# Altium schematic sheet ASIC_2.SchDoc: Title
size A2; Date: Date; CompanyName: Integrated Micro-Electronics Bulgaria; Organization: Design & Development Department; Address1: Drawing Type; Address2: Address 1; Address3: Address 2; Address4: Address 3; DocumentNumber: 730xxx; Revision: 01; SheetNumber: 1; SheetTotal: 1; PageSetup: Record=PageOptions|CenterHorizontal=True|CenterVertical=True|PrintScale=0.70|XCorrection=1.00|YCorrection=1.00|PrintKind=2|BorderSize=5000000|LeftOffset=0|BottomOffset=0|Orientation=2|PaperLength=1000|PaperWidth=1000|Scale=100|PaperSource=7|PrintQuality=-4|MediaType=1|DitherType=10|PaperKind=A4|PrintScaleMode=1; SheetSize: A3; Time: Time; ModifiedDate: Mod. Date
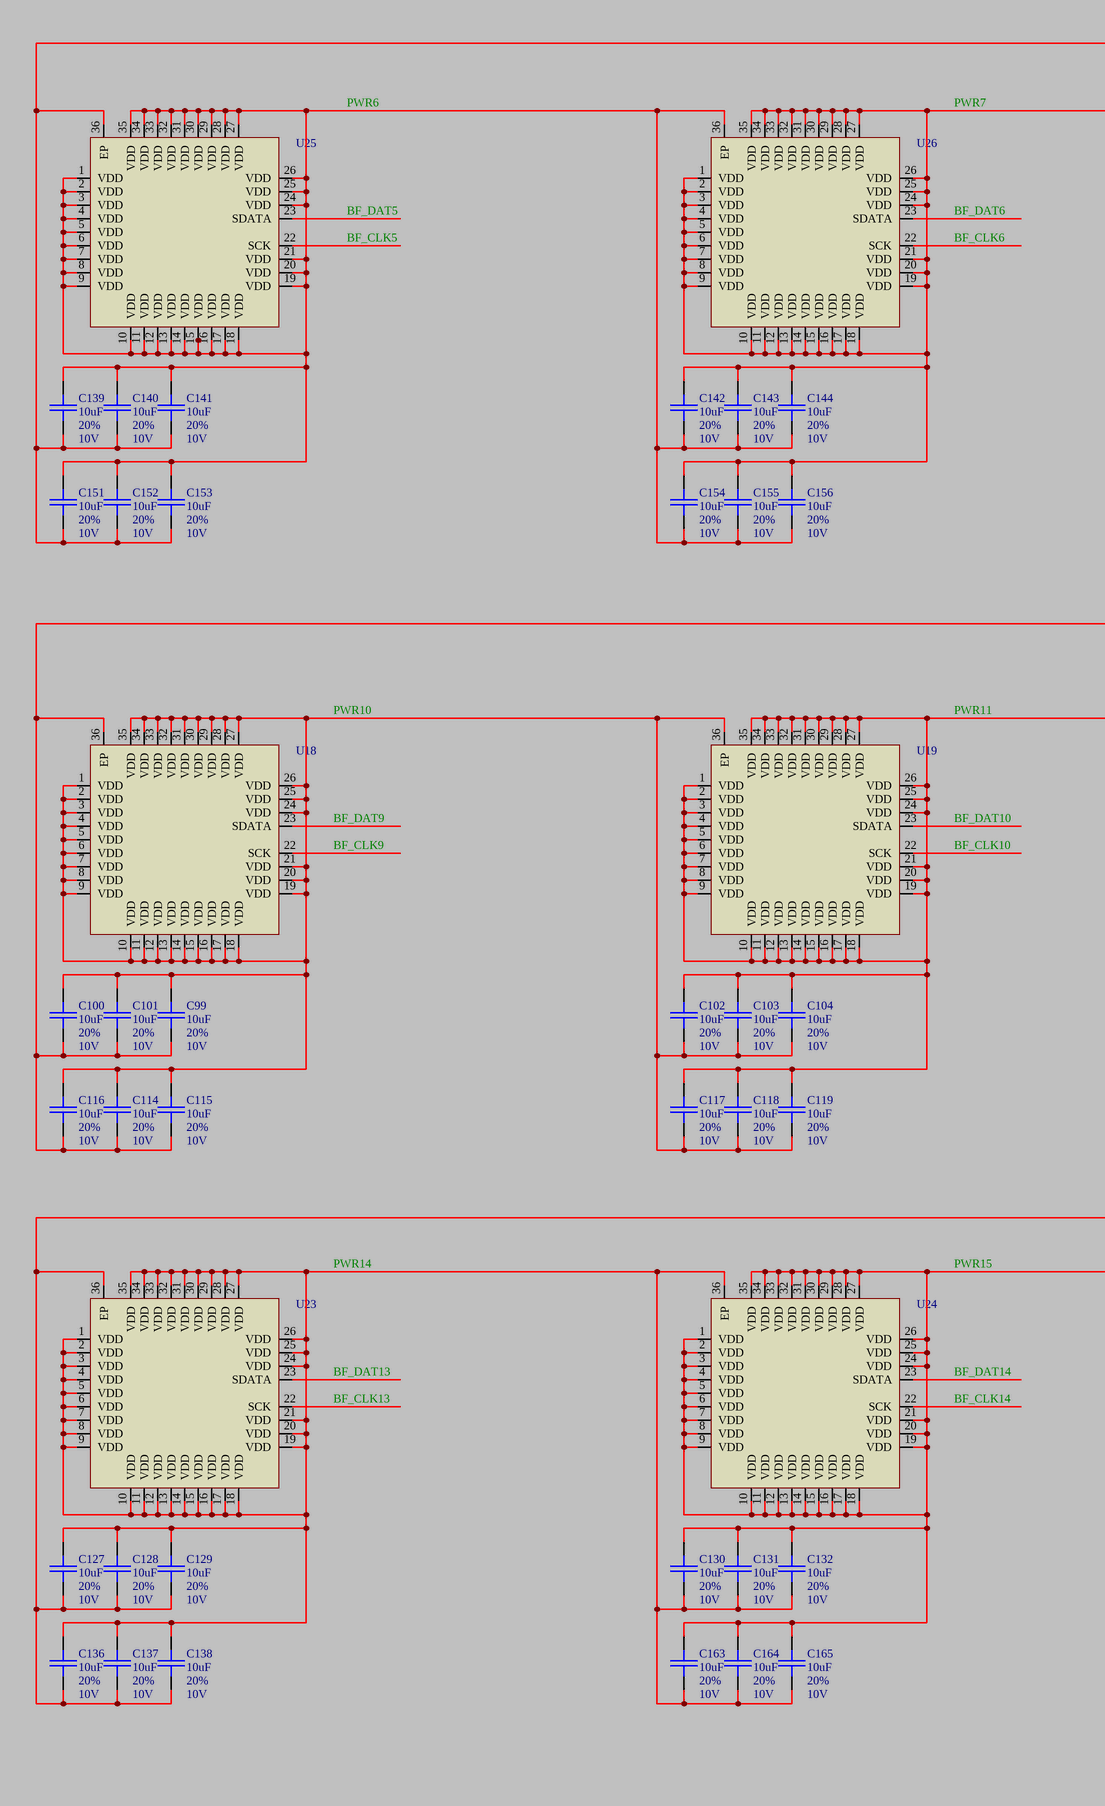
[diagram p0: ASIC_2.SchDoc, left]
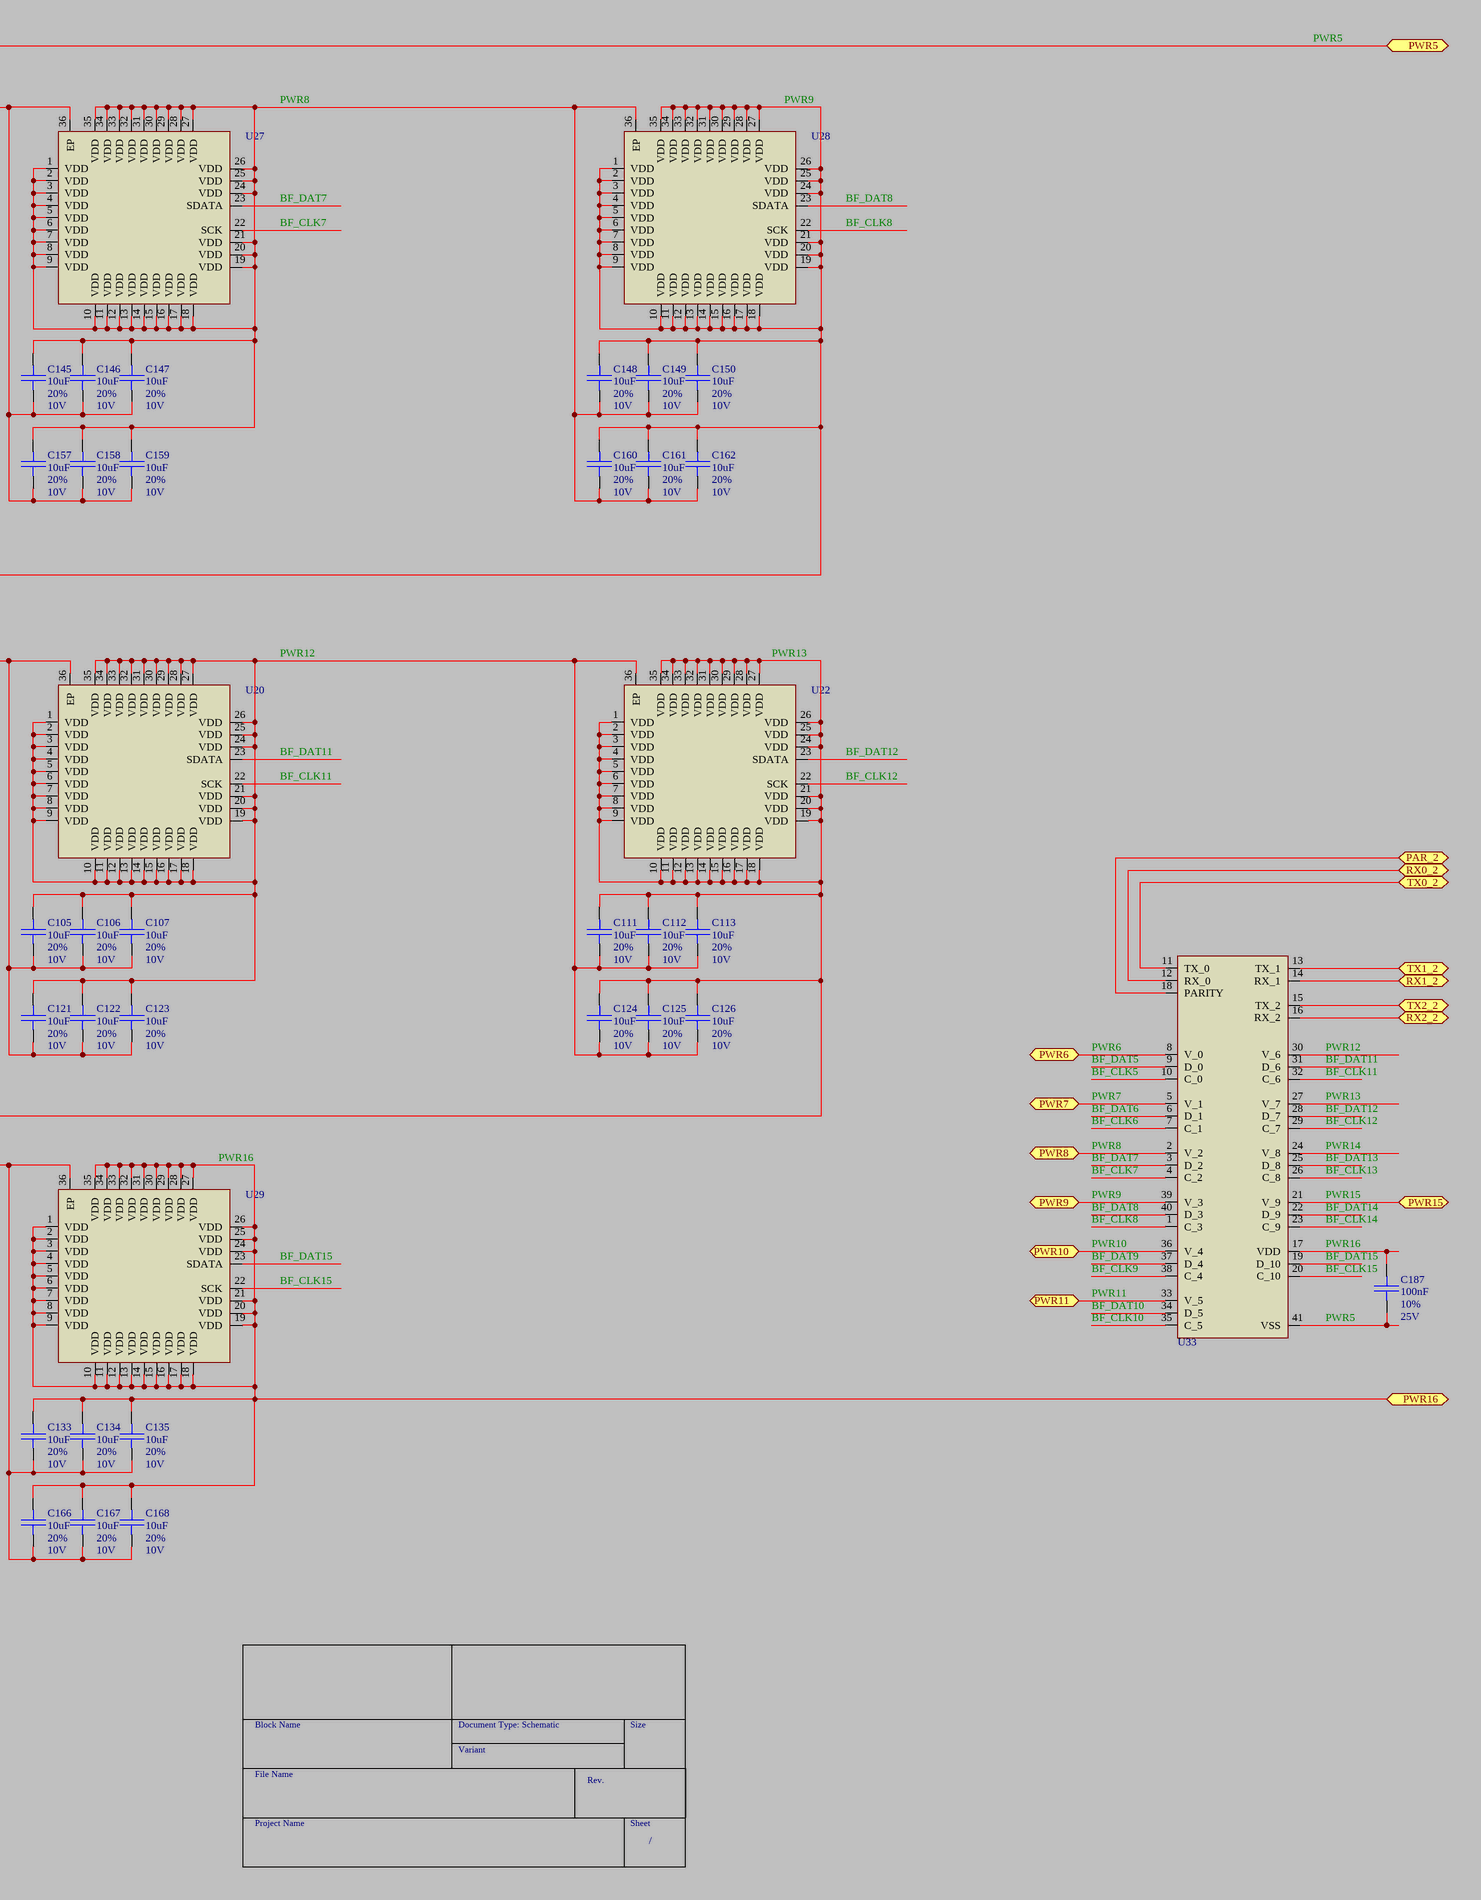
[diagram p1: ASIC_2.SchDoc, right]

## Parts
C99  DB_VALUE: 10uF  DB_TOLERANCE: 20%  DB_VOLTAGE: 10V  [SMD_0402_CAPC1005X70N]  (hidden comment: C)
C100  DB_VALUE: 10uF  DB_TOLERANCE: 20%  DB_VOLTAGE: 10V  [SMD_0402_CAPC1005X70N]  (hidden comment: C)
C101  DB_VALUE: 10uF  DB_TOLERANCE: 20%  DB_VOLTAGE: 10V  [SMD_0402_CAPC1005X70N]  (hidden comment: C)
C102  DB_VALUE: 10uF  DB_TOLERANCE: 20%  DB_VOLTAGE: 10V  [SMD_0402_CAPC1005X70N]  (hidden comment: C)
C103  DB_VALUE: 10uF  DB_TOLERANCE: 20%  DB_VOLTAGE: 10V  [SMD_0402_CAPC1005X70N]  (hidden comment: C)
C104  DB_VALUE: 10uF  DB_TOLERANCE: 20%  DB_VOLTAGE: 10V  [SMD_0402_CAPC1005X70N]  (hidden comment: C)
C105  DB_VALUE: 10uF  DB_TOLERANCE: 20%  DB_VOLTAGE: 10V  [SMD_0402_CAPC1005X70N]  (hidden comment: C)
C106  DB_VALUE: 10uF  DB_TOLERANCE: 20%  DB_VOLTAGE: 10V  [SMD_0402_CAPC1005X70N]  (hidden comment: C)
C107  DB_VALUE: 10uF  DB_TOLERANCE: 20%  DB_VOLTAGE: 10V  [SMD_0402_CAPC1005X70N]  (hidden comment: C)
C111  DB_VALUE: 10uF  DB_TOLERANCE: 20%  DB_VOLTAGE: 10V  [SMD_0402_CAPC1005X70N]  (hidden comment: C)
C112  DB_VALUE: 10uF  DB_TOLERANCE: 20%  DB_VOLTAGE: 10V  [SMD_0402_CAPC1005X70N]  (hidden comment: C)
C113  DB_VALUE: 10uF  DB_TOLERANCE: 20%  DB_VOLTAGE: 10V  [SMD_0402_CAPC1005X70N]  (hidden comment: C)
C114  DB_VALUE: 10uF  DB_TOLERANCE: 20%  DB_VOLTAGE: 10V  [SMD_0402_CAPC1005X70N]  (hidden comment: C)
C115  DB_VALUE: 10uF  DB_TOLERANCE: 20%  DB_VOLTAGE: 10V  [SMD_0402_CAPC1005X70N]  (hidden comment: C)
C116  DB_VALUE: 10uF  DB_TOLERANCE: 20%  DB_VOLTAGE: 10V  [SMD_0402_CAPC1005X70N]  (hidden comment: C)
C117  DB_VALUE: 10uF  DB_TOLERANCE: 20%  DB_VOLTAGE: 10V  [SMD_0402_CAPC1005X70N]  (hidden comment: C)
C118  DB_VALUE: 10uF  DB_TOLERANCE: 20%  DB_VOLTAGE: 10V  [SMD_0402_CAPC1005X70N]  (hidden comment: C)
C119  DB_VALUE: 10uF  DB_TOLERANCE: 20%  DB_VOLTAGE: 10V  [SMD_0402_CAPC1005X70N]  (hidden comment: C)
C121  DB_VALUE: 10uF  DB_TOLERANCE: 20%  DB_VOLTAGE: 10V  [SMD_0402_CAPC1005X70N]  (hidden comment: C)
C122  DB_VALUE: 10uF  DB_TOLERANCE: 20%  DB_VOLTAGE: 10V  [SMD_0402_CAPC1005X70N]  (hidden comment: C)
C123  DB_VALUE: 10uF  DB_TOLERANCE: 20%  DB_VOLTAGE: 10V  [SMD_0402_CAPC1005X70N]  (hidden comment: C)
C124  DB_VALUE: 10uF  DB_TOLERANCE: 20%  DB_VOLTAGE: 10V  [SMD_0402_CAPC1005X70N]  (hidden comment: C)
C125  DB_VALUE: 10uF  DB_TOLERANCE: 20%  DB_VOLTAGE: 10V  [SMD_0402_CAPC1005X70N]  (hidden comment: C)
C126  DB_VALUE: 10uF  DB_TOLERANCE: 20%  DB_VOLTAGE: 10V  [SMD_0402_CAPC1005X70N]  (hidden comment: C)
C127  DB_VALUE: 10uF  DB_TOLERANCE: 20%  DB_VOLTAGE: 10V  [SMD_0402_CAPC1005X70N]  (hidden comment: C)
C128  DB_VALUE: 10uF  DB_TOLERANCE: 20%  DB_VOLTAGE: 10V  [SMD_0402_CAPC1005X70N]  (hidden comment: C)
C129  DB_VALUE: 10uF  DB_TOLERANCE: 20%  DB_VOLTAGE: 10V  [SMD_0402_CAPC1005X70N]  (hidden comment: C)
C130  DB_VALUE: 10uF  DB_TOLERANCE: 20%  DB_VOLTAGE: 10V  [SMD_0402_CAPC1005X70N]  (hidden comment: C)
C131  DB_VALUE: 10uF  DB_TOLERANCE: 20%  DB_VOLTAGE: 10V  [SMD_0402_CAPC1005X70N]  (hidden comment: C)
C132  DB_VALUE: 10uF  DB_TOLERANCE: 20%  DB_VOLTAGE: 10V  [SMD_0402_CAPC1005X70N]  (hidden comment: C)
C133  DB_VALUE: 10uF  DB_TOLERANCE: 20%  DB_VOLTAGE: 10V  [SMD_0402_CAPC1005X70N]  (hidden comment: C)
C134  DB_VALUE: 10uF  DB_TOLERANCE: 20%  DB_VOLTAGE: 10V  [SMD_0402_CAPC1005X70N]  (hidden comment: C)
C135  DB_VALUE: 10uF  DB_TOLERANCE: 20%  DB_VOLTAGE: 10V  [SMD_0402_CAPC1005X70N]  (hidden comment: C)
C136  DB_VALUE: 10uF  DB_TOLERANCE: 20%  DB_VOLTAGE: 10V  [SMD_0402_CAPC1005X70N]  (hidden comment: C)
C137  DB_VALUE: 10uF  DB_TOLERANCE: 20%  DB_VOLTAGE: 10V  [SMD_0402_CAPC1005X70N]  (hidden comment: C)
C138  DB_VALUE: 10uF  DB_TOLERANCE: 20%  DB_VOLTAGE: 10V  [SMD_0402_CAPC1005X70N]  (hidden comment: C)
C139  DB_VALUE: 10uF  DB_TOLERANCE: 20%  DB_VOLTAGE: 10V  [SMD_0402_CAPC1005X70N]  (hidden comment: C)
C140  DB_VALUE: 10uF  DB_TOLERANCE: 20%  DB_VOLTAGE: 10V  [SMD_0402_CAPC1005X70N]  (hidden comment: C)
C141  DB_VALUE: 10uF  DB_TOLERANCE: 20%  DB_VOLTAGE: 10V  [SMD_0402_CAPC1005X70N]  (hidden comment: C)
C142  DB_VALUE: 10uF  DB_TOLERANCE: 20%  DB_VOLTAGE: 10V  [SMD_0402_CAPC1005X70N]  (hidden comment: C)
C143  DB_VALUE: 10uF  DB_TOLERANCE: 20%  DB_VOLTAGE: 10V  [SMD_0402_CAPC1005X70N]  (hidden comment: C)
C144  DB_VALUE: 10uF  DB_TOLERANCE: 20%  DB_VOLTAGE: 10V  [SMD_0402_CAPC1005X70N]  (hidden comment: C)
C145  DB_VALUE: 10uF  DB_TOLERANCE: 20%  DB_VOLTAGE: 10V  [SMD_0402_CAPC1005X70N]  (hidden comment: C)
C146  DB_VALUE: 10uF  DB_TOLERANCE: 20%  DB_VOLTAGE: 10V  [SMD_0402_CAPC1005X70N]  (hidden comment: C)
C147  DB_VALUE: 10uF  DB_TOLERANCE: 20%  DB_VOLTAGE: 10V  [SMD_0402_CAPC1005X70N]  (hidden comment: C)
C148  DB_VALUE: 10uF  DB_TOLERANCE: 20%  DB_VOLTAGE: 10V  [SMD_0402_CAPC1005X70N]  (hidden comment: C)
C149  DB_VALUE: 10uF  DB_TOLERANCE: 20%  DB_VOLTAGE: 10V  [SMD_0402_CAPC1005X70N]  (hidden comment: C)
C150  DB_VALUE: 10uF  DB_TOLERANCE: 20%  DB_VOLTAGE: 10V  [SMD_0402_CAPC1005X70N]  (hidden comment: C)
C151  DB_VALUE: 10uF  DB_TOLERANCE: 20%  DB_VOLTAGE: 10V  [SMD_0402_CAPC1005X70N]  (hidden comment: C)
C152  DB_VALUE: 10uF  DB_TOLERANCE: 20%  DB_VOLTAGE: 10V  [SMD_0402_CAPC1005X70N]  (hidden comment: C)
C153  DB_VALUE: 10uF  DB_TOLERANCE: 20%  DB_VOLTAGE: 10V  [SMD_0402_CAPC1005X70N]  (hidden comment: C)
C154  DB_VALUE: 10uF  DB_TOLERANCE: 20%  DB_VOLTAGE: 10V  [SMD_0402_CAPC1005X70N]  (hidden comment: C)
C155  DB_VALUE: 10uF  DB_TOLERANCE: 20%  DB_VOLTAGE: 10V  [SMD_0402_CAPC1005X70N]  (hidden comment: C)
C156  DB_VALUE: 10uF  DB_TOLERANCE: 20%  DB_VOLTAGE: 10V  [SMD_0402_CAPC1005X70N]  (hidden comment: C)
C157  DB_VALUE: 10uF  DB_TOLERANCE: 20%  DB_VOLTAGE: 10V  [SMD_0402_CAPC1005X70N]  (hidden comment: C)
C158  DB_VALUE: 10uF  DB_TOLERANCE: 20%  DB_VOLTAGE: 10V  [SMD_0402_CAPC1005X70N]  (hidden comment: C)
C159  DB_VALUE: 10uF  DB_TOLERANCE: 20%  DB_VOLTAGE: 10V  [SMD_0402_CAPC1005X70N]  (hidden comment: C)
C160  DB_VALUE: 10uF  DB_TOLERANCE: 20%  DB_VOLTAGE: 10V  [SMD_0402_CAPC1005X70N]  (hidden comment: C)
C161  DB_VALUE: 10uF  DB_TOLERANCE: 20%  DB_VOLTAGE: 10V  [SMD_0402_CAPC1005X70N]  (hidden comment: C)
C162  DB_VALUE: 10uF  DB_TOLERANCE: 20%  DB_VOLTAGE: 10V  [SMD_0402_CAPC1005X70N]  (hidden comment: C)
C163  DB_VALUE: 10uF  DB_TOLERANCE: 20%  DB_VOLTAGE: 10V  [SMD_0402_CAPC1005X70N]  (hidden comment: C)
C164  DB_VALUE: 10uF  DB_TOLERANCE: 20%  DB_VOLTAGE: 10V  [SMD_0402_CAPC1005X70N]  (hidden comment: C)
C165  DB_VALUE: 10uF  DB_TOLERANCE: 20%  DB_VOLTAGE: 10V  [SMD_0402_CAPC1005X70N]  (hidden comment: C)
C166  DB_VALUE: 10uF  DB_TOLERANCE: 20%  DB_VOLTAGE: 10V  [SMD_0402_CAPC1005X70N]  (hidden comment: C)
C167  DB_VALUE: 10uF  DB_TOLERANCE: 20%  DB_VOLTAGE: 10V  [SMD_0402_CAPC1005X70N]  (hidden comment: C)
C168  DB_VALUE: 10uF  DB_TOLERANCE: 20%  DB_VOLTAGE: 10V  [SMD_0402_CAPC1005X70N]  (hidden comment: C)
C187  DB_VALUE: 100nF  DB_TOLERANCE: 10%  DB_VOLTAGE: 25V  [SMD_0402_CAPC1005X55N]  (hidden comment: C)
U18  IC_BITFURY16  [SMD_QFN50P600X600X175-36AN]  (value not drawn)
U19  IC_BITFURY16  [SMD_QFN50P600X600X175-36AN]  (value not drawn)
U20  IC_BITFURY16  [SMD_QFN50P600X600X175-36AN]  (value not drawn)
U22  IC_BITFURY16  [SMD_QFN50P600X600X175-36AN]  (value not drawn)
U23  IC_BITFURY16  [SMD_QFN50P600X600X175-36AN]  (value not drawn)
U24  IC_BITFURY16  [SMD_QFN50P600X600X175-36AN]  (value not drawn)
U25  IC_BITFURY16  [SMD_QFN50P600X600X175-36AN]  (value not drawn)
U26  IC_BITFURY16  [SMD_QFN50P600X600X175-36AN]  (value not drawn)
U27  IC_BITFURY16  [SMD_QFN50P600X600X175-36AN]  (value not drawn)
U28  IC_BITFURY16  [SMD_QFN50P600X600X175-36AN]  (value not drawn)
U29  IC_BITFURY16  [SMD_QFN50P600X600X175-36AN]  (value not drawn)
U33  IC_BTC250  [SMD_QFN40P500X500X80-41N]  (value not drawn)

## Ports
PAR_2, PWR5, PWR6, PWR7, PWR8, PWR9, PWR10, PWR11, PWR15, PWR16, RX0_2, RX1_2, RX2_2, TX0_2, TX1_2, TX2_2

## Nets
BF_CLK5: U25.22(SCK) U33.10(C_0)
BF_CLK6: U26.22(SCK) U33.7(C_1)
BF_CLK7: U27.22(SCK) U33.4(C_2)
BF_CLK8: U28.22(SCK) U33.1(C_3)
BF_CLK9: U18.22(SCK) U33.38(C_4)
BF_CLK10: U19.22(SCK) U33.35(C_5)
BF_CLK11: U20.22(SCK) U33.32(C_6)
BF_CLK12: U22.22(SCK) U33.29(C_7)
BF_CLK13: U23.22(SCK) U33.26(C_8)
BF_CLK14: U24.22(SCK) U33.23(C_9)
BF_CLK15: U29.22(SCK) U33.20(C_10)
BF_DAT5: U25.23(SDATA) U33.9(D_0)
BF_DAT6: U26.23(SDATA) U33.6(D_1)
BF_DAT7: U27.23(SDATA) U33.3(D_2)
BF_DAT8: U28.23(SDATA) U33.40(D_3)
BF_DAT9: U18.23(SDATA) U33.37(D_4)
BF_DAT10: U19.23(SDATA) U33.34(D_5)
BF_DAT11: U20.23(SDATA) U33.31(D_6)
BF_DAT12: U22.23(SDATA) U33.28(D_7)
BF_DAT13: U23.23(SDATA) U33.25(D_8)
BF_DAT14: U24.23(SDATA) U33.22(D_9)
BF_DAT15: U29.23(SDATA) U33.19(D_10)
PAR_2: U33.18(PARITY) ; port PAR_2
PWR5: C139.2 C140.2 C141.2 C151.2 C152.2 C153.2 C187.2 U25.36(EP) U33.41(VSS) ; port PWR5
PWR6: C139.1 C140.1 C141.1 C142.2 C143.2 C144.2 C151.1 C152.1 C153.1 C154.2 C155.2 C156.2 U25.1(VDD) U25.2(VDD) U25.3(VDD) U25.4(VDD) U25.5(VDD) U25.6(VDD) U25.7(VDD) U25.8(VDD) U25.9(VDD) U25.10(VDD) U25.11(VDD) U25.12(VDD) U25.13(VDD) U25.14(VDD) U25.15(VDD) U25.16(VDD) U25.17(VDD) U25.18(VDD) U25.19(VDD) U25.20(VDD) U25.21(VDD) U25.24(VDD) U25.25(VDD) U25.26(VDD) U25.27(VDD) U25.28(VDD) U25.29(VDD) U25.30(VDD) U25.31(VDD) U25.32(VDD) U25.33(VDD) U25.34(VDD) U25.35(VDD) U26.36(EP) U33.8(V_0) ; port PWR6
PWR7: C142.1 C143.1 C144.1 C145.2 C146.2 C147.2 C154.1 C155.1 C156.1 C157.2 C158.2 C159.2 U26.1(VDD) U26.2(VDD) U26.3(VDD) U26.4(VDD) U26.5(VDD) U26.6(VDD) U26.7(VDD) U26.8(VDD) U26.9(VDD) U26.10(VDD) U26.11(VDD) U26.12(VDD) U26.13(VDD) U26.14(VDD) U26.15(VDD) U26.16(VDD) U26.17(VDD) U26.18(VDD) U26.19(VDD) U26.20(VDD) U26.21(VDD) U26.24(VDD) U26.25(VDD) U26.26(VDD) U26.27(VDD) U26.28(VDD) U26.29(VDD) U26.30(VDD) U26.31(VDD) U26.32(VDD) U26.33(VDD) U26.34(VDD) U26.35(VDD) U27.36(EP) U33.5(V_1) ; port PWR7
PWR8: C145.1 C146.1 C147.1 C148.2 C149.2 C150.2 C157.1 C158.1 C159.1 C160.2 C161.2 C162.2 U27.1(VDD) U27.2(VDD) U27.3(VDD) U27.4(VDD) U27.5(VDD) U27.6(VDD) U27.7(VDD) U27.8(VDD) U27.9(VDD) U27.10(VDD) U27.11(VDD) U27.12(VDD) U27.13(VDD) U27.14(VDD) U27.15(VDD) U27.16(VDD) U27.17(VDD) U27.18(VDD) U27.19(VDD) U27.20(VDD) U27.21(VDD) U27.24(VDD) U27.25(VDD) U27.26(VDD) U27.27(VDD) U27.28(VDD) U27.29(VDD) U27.30(VDD) U27.31(VDD) U27.32(VDD) U27.33(VDD) U27.34(VDD) U27.35(VDD) U28.36(EP) U33.2(V_2) ; port PWR8
PWR9: C99.2 C100.2 C101.2 C114.2 C115.2 C116.2 C148.1 C149.1 C150.1 C160.1 C161.1 C162.1 U18.36(EP) U28.1(VDD) U28.2(VDD) U28.3(VDD) U28.4(VDD) U28.5(VDD) U28.6(VDD) U28.7(VDD) U28.8(VDD) U28.9(VDD) U28.10(VDD) U28.11(VDD) U28.12(VDD) U28.13(VDD) U28.14(VDD) U28.15(VDD) U28.16(VDD) U28.17(VDD) U28.18(VDD) U28.19(VDD) U28.20(VDD) U28.21(VDD) U28.24(VDD) U28.25(VDD) U28.26(VDD) U28.27(VDD) U28.28(VDD) U28.29(VDD) U28.30(VDD) U28.31(VDD) U28.32(VDD) U28.33(VDD) U28.34(VDD) U28.35(VDD) U33.39(V_3) ; port PWR9
PWR10: C99.1 C100.1 C101.1 C102.2 C103.2 C104.2 C114.1 C115.1 C116.1 C117.2 C118.2 C119.2 U18.1(VDD) U18.2(VDD) U18.3(VDD) U18.4(VDD) U18.5(VDD) U18.6(VDD) U18.7(VDD) U18.8(VDD) U18.9(VDD) U18.10(VDD) U18.11(VDD) U18.12(VDD) U18.13(VDD) U18.14(VDD) U18.15(VDD) U18.16(VDD) U18.17(VDD) U18.18(VDD) U18.19(VDD) U18.20(VDD) U18.21(VDD) U18.24(VDD) U18.25(VDD) U18.26(VDD) U18.27(VDD) U18.28(VDD) U18.29(VDD) U18.30(VDD) U18.31(VDD) U18.32(VDD) U18.33(VDD) U18.34(VDD) U18.35(VDD) U19.36(EP) U33.36(V_4) ; port PWR10
PWR11: C102.1 C103.1 C104.1 C105.2 C106.2 C107.2 C117.1 C118.1 C119.1 C121.2 C122.2 C123.2 U19.1(VDD) U19.2(VDD) U19.3(VDD) U19.4(VDD) U19.5(VDD) U19.6(VDD) U19.7(VDD) U19.8(VDD) U19.9(VDD) U19.10(VDD) U19.11(VDD) U19.12(VDD) U19.13(VDD) U19.14(VDD) U19.15(VDD) U19.16(VDD) U19.17(VDD) U19.18(VDD) U19.19(VDD) U19.20(VDD) U19.21(VDD) U19.24(VDD) U19.25(VDD) U19.26(VDD) U19.27(VDD) U19.28(VDD) U19.29(VDD) U19.30(VDD) U19.31(VDD) U19.32(VDD) U19.33(VDD) U19.34(VDD) U19.35(VDD) U20.36(EP) U33.33(V_5) ; port PWR11
PWR12: C105.1 C106.1 C107.1 C111.2 C112.2 C113.2 C121.1 C122.1 C123.1 C124.2 C125.2 C126.2 U20.1(VDD) U20.2(VDD) U20.3(VDD) U20.4(VDD) U20.5(VDD) U20.6(VDD) U20.7(VDD) U20.8(VDD) U20.9(VDD) U20.10(VDD) U20.11(VDD) U20.12(VDD) U20.13(VDD) U20.14(VDD) U20.15(VDD) U20.16(VDD) U20.17(VDD) U20.18(VDD) U20.19(VDD) U20.20(VDD) U20.21(VDD) U20.24(VDD) U20.25(VDD) U20.26(VDD) U20.27(VDD) U20.28(VDD) U20.29(VDD) U20.30(VDD) U20.31(VDD) U20.32(VDD) U20.33(VDD) U20.34(VDD) U20.35(VDD) U22.36(EP) U33.30(V_6)
PWR13: C111.1 C112.1 C113.1 C124.1 C125.1 C126.1 C127.2 C128.2 C129.2 C136.2 C137.2 C138.2 U22.1(VDD) U22.2(VDD) U22.3(VDD) U22.4(VDD) U22.5(VDD) U22.6(VDD) U22.7(VDD) U22.8(VDD) U22.9(VDD) U22.10(VDD) U22.11(VDD) U22.12(VDD) U22.13(VDD) U22.14(VDD) U22.15(VDD) U22.16(VDD) U22.17(VDD) U22.18(VDD) U22.19(VDD) U22.20(VDD) U22.21(VDD) U22.24(VDD) U22.25(VDD) U22.26(VDD) U22.27(VDD) U22.28(VDD) U22.29(VDD) U22.30(VDD) U22.31(VDD) U22.32(VDD) U22.33(VDD) U22.34(VDD) U22.35(VDD) U23.36(EP) U33.27(V_7)
PWR14: C127.1 C128.1 C129.1 C130.2 C131.2 C132.2 C136.1 C137.1 C138.1 C163.2 C164.2 C165.2 U23.1(VDD) U23.2(VDD) U23.3(VDD) U23.4(VDD) U23.5(VDD) U23.6(VDD) U23.7(VDD) U23.8(VDD) U23.9(VDD) U23.10(VDD) U23.11(VDD) U23.12(VDD) U23.13(VDD) U23.14(VDD) U23.15(VDD) U23.16(VDD) U23.17(VDD) U23.18(VDD) U23.19(VDD) U23.20(VDD) U23.21(VDD) U23.24(VDD) U23.25(VDD) U23.26(VDD) U23.27(VDD) U23.28(VDD) U23.29(VDD) U23.30(VDD) U23.31(VDD) U23.32(VDD) U23.33(VDD) U23.34(VDD) U23.35(VDD) U24.36(EP) U33.24(V_8)
PWR15: C130.1 C131.1 C132.1 C133.2 C134.2 C135.2 C163.1 C164.1 C165.1 C166.2 C167.2 C168.2 U24.1(VDD) U24.2(VDD) U24.3(VDD) U24.4(VDD) U24.5(VDD) U24.6(VDD) U24.7(VDD) U24.8(VDD) U24.9(VDD) U24.10(VDD) U24.11(VDD) U24.12(VDD) U24.13(VDD) U24.14(VDD) U24.15(VDD) U24.16(VDD) U24.17(VDD) U24.18(VDD) U24.19(VDD) U24.20(VDD) U24.21(VDD) U24.24(VDD) U24.25(VDD) U24.26(VDD) U24.27(VDD) U24.28(VDD) U24.29(VDD) U24.30(VDD) U24.31(VDD) U24.32(VDD) U24.33(VDD) U24.34(VDD) U24.35(VDD) U29.36(EP) U33.21(V_9) ; port PWR15
PWR16: C133.1 C134.1 C135.1 C166.1 C167.1 C168.1 C187.1 U29.1(VDD) U29.2(VDD) U29.3(VDD) U29.4(VDD) U29.5(VDD) U29.6(VDD) U29.7(VDD) U29.8(VDD) U29.9(VDD) U29.10(VDD) U29.11(VDD) U29.12(VDD) U29.13(VDD) U29.14(VDD) U29.15(VDD) U29.16(VDD) U29.17(VDD) U29.18(VDD) U29.19(VDD) U29.20(VDD) U29.21(VDD) U29.24(VDD) U29.25(VDD) U29.26(VDD) U29.27(VDD) U29.28(VDD) U29.29(VDD) U29.30(VDD) U29.31(VDD) U29.32(VDD) U29.33(VDD) U29.34(VDD) U29.35(VDD) U33.17(VDD) ; port PWR16
RX0_2: U33.12(RX_0) ; port RX0_2
RX1_2: U33.14(RX_1) ; port RX1_2
RX2_2: U33.16(RX_2) ; port RX2_2
TX0_2: U33.11(TX_0) ; port TX0_2
TX1_2: U33.13(TX_1) ; port TX1_2
TX2_2: U33.15(TX_2) ; port TX2_2

## Notes on the sheet
- Block Name
- Document Type: Schematic
- Size
- File Name
- Variant
- Rev.
- Project Name
- Sheet
- /

## Library data of the parts
C99-C107 C111-C119 C121-C168 = CAP000047481: DB_PART_TYPE: Ceramic_SMD\Standard_X5R; DB_MANUFACTURER_PART: SAMSUNG    CL05A106MP5NUNC; NOTE: <NOTE>; DB_T_RANGE: -55 to 85; DB_PACKAGE: 0402; DB_DESCRIPTION: C X5R 10uF 20% 10V 0402; DB_APPROVED_BY: VSN; DB_STATUS: NEW; DB_PART_NUMBER: CAP000047481; DB_PCB_DEVICE: SMD_0402_CAPC1005X70N; DB_APPROVED_ON: 20.04.2016 14:32:27; DB_DATASHEET: http://john.epiqdesign.com/projects/CIS_Datasheets/CAP_S_CL05A106MP5NUNC.pdf?rev=2053&sc=0
C187 = CAP000047469: DB_PART_TYPE: Ceramic_SMD\Standard_X5R; DB_MANUFACTURER_PART: SAMSUNG    CL05A104KA5NNNC; NOTE: <NOTE>; DB_T_RANGE: -55 to 85; DB_PACKAGE: 0402; DB_DESCRIPTION: C X5R 100nF 10% 25V 0402; DB_APPROVED_BY: VSN; DB_STATUS: NEW; DB_PART_NUMBER: CAP000047469; DB_PCB_DEVICE: SMD_0402_CAPC1005X55N; DB_APPROVED_ON: 08.03.2016 08:26:43; DB_DATASHEET: http://john.epiqdesign.com/projects/CIS_Datasheets/CAP_CL05A104KA5NNNC_100nF_X5R_25V_10_0402_Samsung.pdf?rev=1997&sc=0
U18-U20 U22-U29 = IC_BITFURY16: BitFury 2016 16 nm; DB_PCB_DEVICE: SMD_QFN50P600X600X175-36AN
U33 = IC_BTC250: DB_PCB_DEVICE: SMD_QFN40P500X500X80-41N